# Altium project HEATER SYSTEM PID.PrjPcb
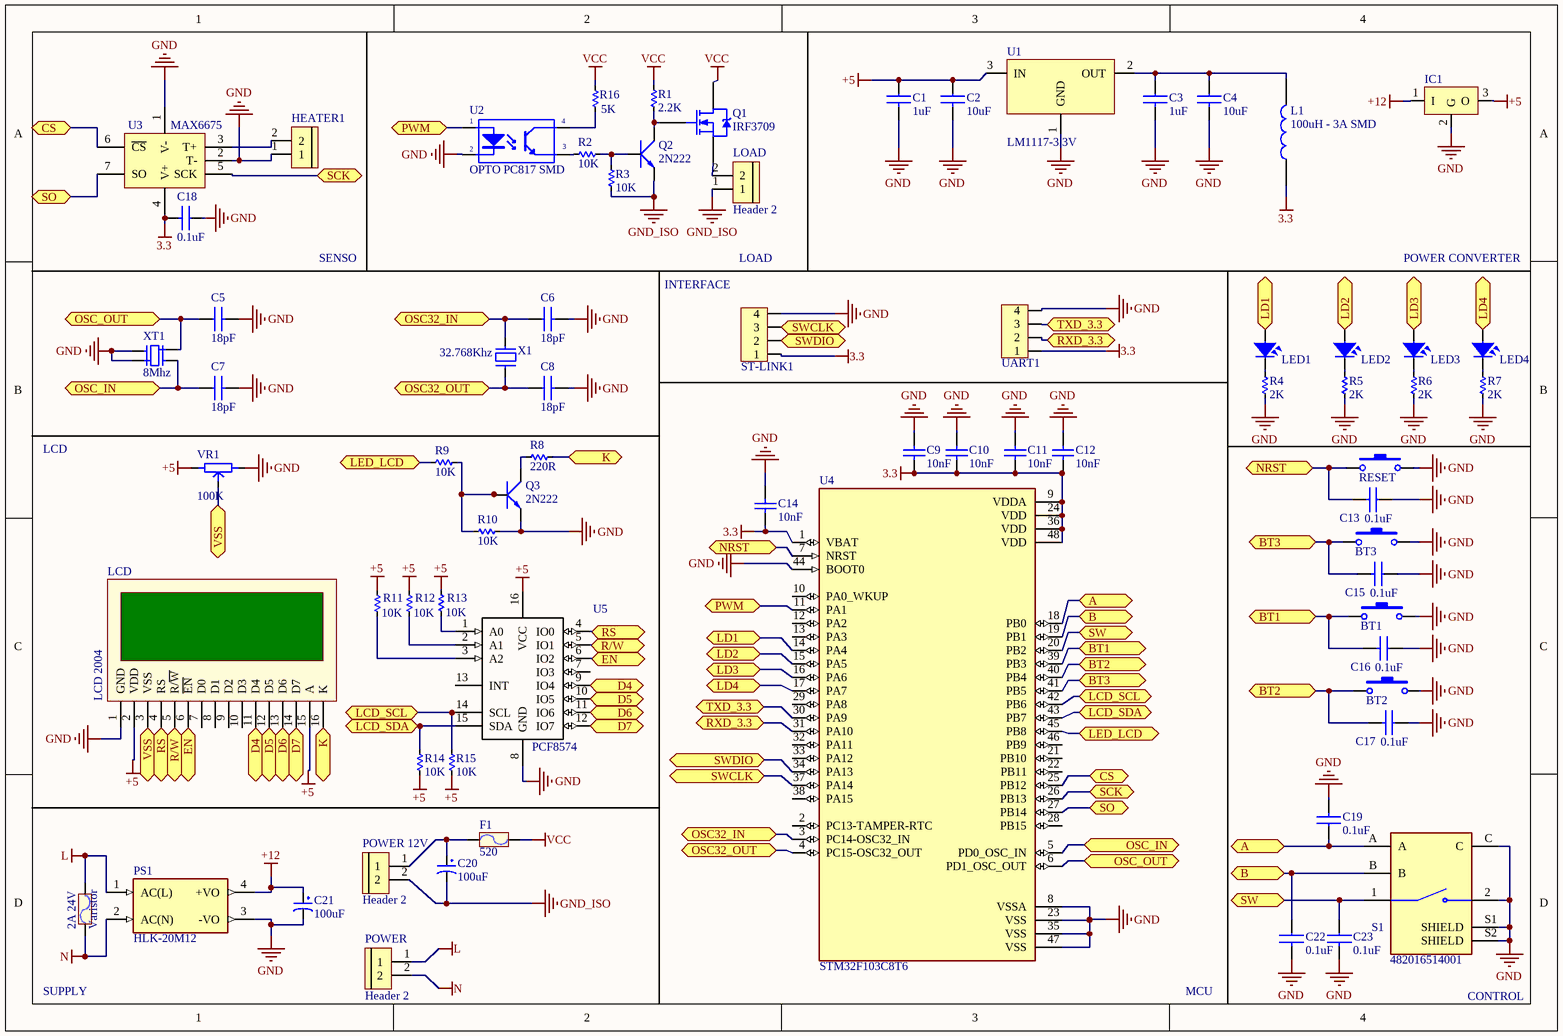
[diagram p0: Sheet1.SchDoc]
1 sheet, 71 parts. Net scope: flat (ports and power ports of the same name join across sheets).
Board file: PCB1.PcbDoc

## Sheet Sheet1.SchDoc
size A4; SheetNumber: 1; SheetTotal: 1

### Parts
BT1  SW-SMD  [SW-SMD]  (value not drawn)
BT2  SW-SMD  [SW-SMD]  (value not drawn)
BT3  SW-SMD  [SW-SMD]  (value not drawn)
C1  1uF  [0805]
C2  10uF  [0805]
C3  1uF  [0805]
C4  10uF  [0805]
C5  18pF  [0805]
C6  18pF  [0805]
C7  18pF  [0805]
C8  18pF  [0805]
C9  10nF  [tu 0805]
C10  10nF  [tu 0805]
C11  10nF  [tu 0805]
C12  10nF  [tu 0805]
C13  0.1uF  [0805]
C14  10nF  [tu 0805]
C15  0.1uF  [0805]
C16  0.1uF  [0805]
C17  0.1uF  [0805]
C18  0.1uF  [0805]
C19  0.1uF  [0805]
C20  100uF  [tu hoa 5mm]
C21  100uF  [tu hoa 5mm]
C22  0.1uF  [0805]
C23  0.1uF  [0805]
F1  520  [De Cau Chi 520 630]
HEATER1  Header 2  [BIG_Header 2]  (value not drawn)
IC1  LM78xx  [TO252-123]  (value not drawn)
L1  100uH - 3A SMD  [Cuon Cam 12x12x10]
LCD  LCD 2004  [LCD 2004]
LED1  LED  [LED-0805-Red]  (value not drawn)
LED2  LED  [LED-0805-Red]  (value not drawn)
LED3  LED  [LED-0805-Red]  (value not drawn)
LED4  LED  [LED-0805-Red]  (value not drawn)
LOAD  Header 2  [BIG_Header 2]
POWER  Header 2  [BIG_Header 2]
POWER_12V  Header 2  [BIG_Header 2]
PS1  HLK-20M12  [CONV_HLK-20M12]
Q1  IRF3709  [D2PAK]
Q2  2N222  [SOT23-231]
Q3  2N222  [SOT23-231]
R1  2.2K  [RES-SMD-1206]
R2  10K  [RES-SMD-1206]
R3  10K  [RES-SMD-1206]
R4  2K  [RES-SMD-0805]
R5  2K  [RES-SMD-0805]
R6  2K  [RES-SMD-0805]
R7  2K  [RES-SMD-0805]
R8  220R  [RES-SMD-0805]
R9  10K  [RES-SMD-0805]
R10  10K  [RES-SMD-0805]
R11  10K  [RES-SMD-0805]
R12  10K  [RES-SMD-0805]
R13  10K  [RES-SMD-0805]
R14  10K  [RES-SMD-0805]
R15  10K  [RES-SMD-0805]
R16  5K  [RES-SMD-1206]
RESET  SW-SMD  [SW-SMD]  (value not drawn)
S1  482016514001  [SW_482016514001]
ST-LINK1  Header4  [Header4]  (value not drawn)
U1  LM1117-3.3V  [SOT223]
U2  OPTO PC817 SMD  [SOP4]
U3  MAX6675  [SO8]
U4  STM32F103C8T6  [QFP50P900X900X160-48N]
U5  PCF8574  [SO16L]
UART1  Header4  [Header4]  (value not drawn)
Varistor  2A 24V  [Cau chi tu phuc hoi 2A 24V SMD1812]
VR1  100K  [Bien Tro Tam Giac Dung]
X1  32.768Khz  [XT2-32.768KHz-2_V]
XT1  8Mhz  [Thach Anh 4 chan 1]

### Ports
A (bidir), B (bidir), BT1 (bidir), BT2 (bidir), BT3 (bidir), CS (bidir), D4 (bidir), D5 (bidir), D6 (bidir), D7 (bidir), EN (bidir), K (bidir), LCD_SCL (bidir), LCD_SDA (bidir), LD1 (bidir), LD2 (bidir), LD3 (bidir), LD4 (bidir), LED_LCD (bidir), NRST (bidir), OSC32_IN (bidir), OSC32_OUT (bidir), OSC_IN (bidir), OSC_OUT (bidir), PWM (bidir), R/W (bidir), RS (bidir), RXD_3.3 (bidir), SCK (bidir), SO (bidir), SW (bidir), SWCLK (bidir), SWDIO (bidir), TXD_3.3 (bidir), VSS (bidir)

### Nets
3.3: C9.2 C10.2 C11.2 C12.2 C14.2 C18.2 L1.1 ST-LINK1.1 U3.4(V+) U4.1(VBAT) U4.9(VDDA) U4.24(VDD) U4.36(VDD) U4.48(VDD) UART1.1
+5: C1.1 C2.1 IC1.3(O) LCD.2(VDD) LCD.15(A) R11.1 R12.1 R13.1 R14.1 R15.1 U1.3(IN) U5.16(VCC) VR1.3
+12: C21.1 IC1.1(I) PS1.4(+VO)
GND: BT1.2 BT2.2 BT3.2 C1.2 C2.2 C3.2 C4.2 C5.2 C6.2 C7.2 C8.2 C9.1 C10.1 C11.1 C12.1 C13.1 C14.1 C15.1 C16.1 C17.1 C18.1 C19.2 C21.2 C22.2 C23.2 HEATER1.1 IC1.2(G) LCD.1(GND) PS1.3(-VO) Q3.1(E) R4.2 R5.2 R6.2 R7.2 R10.1 RESET.2 S1.2 S1.C S1.S1(SHIELD) S1.S2(SHIELD) ST-LINK1.4 U1.1(GND) U2.2(K) U3.1(V-) U3.2(T-) U4.8(VSSA) U4.23(VSS) U4.35(VSS) U4.44(BOOT0) U4.47(VSS) U5.8(GND) UART1.4 VR1.1 XT1.2 XT1.4
GND_ISO: C20.2 LOAD.1 POWER_12V.2 Q2.1(E) R3.2
L: POWER.1 PS1.1(AC(L)) Varistor.2
N: POWER.2 PS1.2(AC(N)) Varistor.1
VCC: F1.2 Q1.2(D) R1.1 R16.2
NetBT1_1: BT1.1 C16.2 U4.39(PB3) ; port BT1
NetBT2_1: BT2.1 C17.2 U4.40(PB4) ; port BT2
NetBT3_1: BT3.1 C15.2 U4.41(PB5) ; port BT3
NetC3_1: C3.1 C4.1 L1.2 U1.2(OUT)
NetC5_1: C5.1 U4.6(PD1_OSC_OUT) XT1.3 ; port OSC_OUT
NetC6_1: C6.1 U4.3(PC14-OSC32_IN) X1.2 ; port OSC32_IN
NetC7_1: C7.1 U4.5(PD0_OSC_IN) XT1.1 ; port OSC_IN
NetC8_1: C8.1 U4.4(PC15-OSC32_OUT) X1.1 ; port OSC32_OUT
NetC13_2: C13.2 RESET.1 U4.7(NRST) ; port NRST
NetC19_1: C19.1 S1.A U4.18(PB0) ; port A
NetC20_1: C20.1 F1.1 POWER_12V.1
NetC22_1: C22.1 S1.B U4.19(PB1) ; port B
NetC23_1: C23.1 S1.1 U4.20(PB2) ; port SW
NetHEATER1_2: HEATER1.2 U3.3(T+)
NetLCD_3: LCD.3(VSS) VR1.2 ; port VSS
NetLCD_4: LCD.4(RS) U5.4(IO0) ; port RS
NetLCD_5: LCD.5(R/~{W}) U5.5(IO1) ; port R/W
NetLCD_6: LCD.6(~{EN}) U5.6(IO2) ; port EN
NetLCD_11: LCD.11(D4) U5.9(IO4) ; port D4
NetLCD_12: LCD.12(D5) U5.10(IO5) ; port D5
NetLCD_13: LCD.13(D6) U5.11(IO6) ; port D6
NetLCD_14: LCD.14(D7) U5.12(IO7) ; port D7
NetLCD_16: LCD.16(K) R8.1 ; port K
NetLED1_1: LED1.1 U4.14(PA4) ; port LD1
NetLED1_2: LED1.2 R4.1
NetLED2_1: LED2.1 U4.15(PA5) ; port LD2
NetLED2_2: LED2.2 R5.1
NetLED3_1: LED3.1 U4.16(PA6) ; port LD3
NetLED3_2: LED3.2 R6.1
NetLED4_1: LED4.1 U4.17(PA7) ; port LD4
NetLED4_2: LED4.2 R7.1
NetLOAD_2: LOAD.2 Q1.3(S)
NetQ1_1: Q1.1(G) Q2.3(C) R1.2
NetQ2_2: Q2.2(B) R2.2 R3.1
NetQ3_2: Q3.2(B) R9.1 R10.2
NetQ3_3: Q3.3(C) R8.2
NetR2_1: R2.1 U2.3(E)
NetR9_2: R9.2 U4.45(PB8) ; port LED_LCD
NetR11_2: R11.2 U5.3(A2)
NetR12_2: R12.2 U5.2(A1)
NetR13_2: R13.2 U5.1(A0)
NetR14_2: R14.2 U4.43(PB7) U5.15(SDA) ; port LCD_SDA
NetR15_2: R15.2 U4.42(PB6) U5.14(SCL) ; port LCD_SCL
NetR16_1: R16.1 U2.4(C)
NetST-LINK1_2: ST-LINK1.2 U4.34(PA13) ; port SWDIO
NetST-LINK1_3: ST-LINK1.3 U4.37(PA14) ; port SWCLK
NetU2_1: U2.1(A) U4.11(PA1) ; port PWM
NetU3_5: U3.5(SCK) U4.26(PB13) ; port SCK
NetU3_6: U3.6(~{CS}) U4.25(PB12) ; port CS
NetU3_7: U3.7(SO) U4.27(PB14) ; port SO
NetU4_30: U4.30(PA9) UART1.3 ; port TXD_3.3
NetU4_31: U4.31(PA10) UART1.2 ; port RXD_3.3

Not connected (* = marked no-connect by the designer): LCD 7(D0) 8(D1) 9(D2) 10(D3); U4 2(PC13-TAMPER-RTC) 10(PA0_WKUP) 12(PA2) 13(PA3) 21(PB10) 22(PB11) 28(PB15) 29(PA8) 32(PA11) 33(PA12) 38(PA15) 46(PB9); U5 7(IO3) 13(INT)

### Notes on the sheet
- SENSO
- (near ST-LINK1) INTERFACE
- LOAD
- POWER CONVERTER
- LCD
- SUPPLY
- MCU
- (near S1) CONTROL

### Library data of the parts
BT1-BT3 RESET = SW-SMD: Switch; Published: 24-Mar-1999; LatestRevisionDate: 17-Jul-2002; LatestRevisionNote: Re-released for DXP Platform.; PackageReference: SPST-2; Publisher: Altium Limited
C1-C8 C13 C15-C19 C22 C23 = CAP 0805: Right: 20; Bottom: 10
C9-C12 C14 = Tu 0805 101 50V 20%: Dán; Don_Vi: Con; So_Chan: 2; Ten_Linh_Kien: Tụ 0805 101-0.1nF 50V 20%; Ma_Hang: MH002806; Chung_Loai: Dán; Kieu_Chan: *
C20 C21 = Tu Hoa 100uF 25V 6x11: Cắm; Don_Vi: Con; So_Chan: 2; Ten_Linh_Kien: Tụ Hóa 100uF 25V 6x11MM; Ma_Hang: MH001351; Chung_Loai: Cắm; Kieu_Chan: *
F1 = De Cau Chi 520 630: 5x20mm; Ma_Hang: MH001473; Ten: Đế Cầu Chì 5x20MM 6x30MM SMD01
HEATER1 LOAD POWER POWER_12V = Header 2: Big Header 2
IC1 = LM78xx: Positive Voltage Regulator; Note: Tab is connected to pin 3 (GND).; Published: 24-Aug-2001; LatestRevisionDate: 17-Jul-2002; LatestRevisionNote: Re-released for DXP Platform.; DatasheetVersion: Apr-1994; PackageVersion: Jul-1998; PackageReference: ISOWATT220AB; Publisher: Altium Limited; PackageDescription: TO, Thru-Hole, Vertical, Heatsink Mounted; 3 In-Line Leads; Pitch 2.54 mm; Pin sequence 1, 3, 2; ComponentLink1Description: Manufacturer Link; ComponentLink1URL: http://www.st.com/; ComponentLink2Description: Datasheet; ComponentLink2URL: http://www.st.com/stonline/products/literature/ds/2146/l78m05c.pdf
L1 = CUON CAM 100uH SMD: Dán; Don_Vi: Con; Ma_Hang: MH003999; Ten_Linh_Kien: Cuộn Cảm 100uH 7x7x4MM CD74; Ma_Hang: *; Kieu_Chan: *; Chung_Loai: Dán
LCD = LCD 2004 5V: LCD 2004 5V Xanh Dương; Ten: LCD 2004 Xanh Dương; Ma_Hang: WVEZ; CHIP: HD44780; Don Vi Mua: Nshop
LED1-LED4 = LED SMD: Value: LED 3 - 5 ly 2 Colour
PS1 = HLK-20M12: 20W ultra-small series module power supply; MF: Hi-link; Check_prices: https://www.snapeda.com/parts/HLK-20M12/Hi-link/view-part/?ref=eda; SnapEDA_Link: https://www.snapeda.com/parts/HLK-20M12/Hi-link/view-part/?ref=snap; Availability: Not in stock; Price: None; Value: *; MP: HLK-20M12; Package: Non-Standard Hi-link
Q1 = IRF3709S SMD: N-Channel Power MOSFET
Q2 Q3 = 2N222: NPN 600mW, ECB; Value: C1815
R1-R16 = Res-SMD: Resistor; Manufacturer: Generic Components; Class: Passive; Published: 08/06/2000; Publisher: Altium Hobart Technology Centre
S1 = 482016514001: Rotary Encoder Mechanical 15 Quadrature (Incremental) Vertical; MF: WÃ¼rth Elektronik; Purchase-URL: https://pricing.snapeda.com/search/part/482016514001/?ref=eda; MP: 482016514001; Package: None; Availability: In Stock; Value: *; Price: None; Check_prices: https://www.snapeda.com/parts/482016514001/Wurth+Electronics+Inc./view-part/?ref=eda; SnapEDA_Link: https://www.snapeda.com/parts/482016514001/Wurth+Electronics+Inc./view-part/?ref=snap
ST-LINK1 UART1 = Header4: Header IDC, 4 x 1 Pin Vertical 2.54mm Pitch (Non-Boxed, Male); Manufacturer: W¨¹rth Elektronik eiSos GmbH; partNo: 613002143121; ComponentLink1 Description: Manufacturer; ComponentLink2 Description: Datasheet; NoPins: 02; Created Date: 29 March 2013; ComponentLink1URL: http://www.we-online.com; ComponentLink2URL: http://katalog.we-online.de/em/datasheet/6130xx143121.pdf; Created by: Karrer Zheng
U1 = LM1117: 800mA Low-Dropout Linear Regulator; Creator: Nguyen Ba Bien; Website: http://group3i.net
U2 = OPTO PC817 SMD: Single Opto; Value: PC817
U3 = MAX6675: Half-Bridge Driver
U4 = STM32F103C8T6: ARMÂ® CortexÂ®-M3 STM32F1 Microcontroller IC 32-Bit 72MHz 64KB (64K x 8) FLASH 48-LQFP (7x7); MF: STMicroelectronics; Package: LQFP-48 STMicroelectronics; Price: None; Check_prices: https://www.snapeda.com/parts/STM32F103C8T6/STMicroelectronics/view-part/?ref=eda; Value: *; SnapEDA_Link: https://www.snapeda.com/parts/STM32F103C8T6/STMicroelectronics/view-part/?ref=snap; MP: STM32F103C8T6; Availability: In Stock; Purchase-URL: https://pricing.snapeda.com/search/part/STM32F103C8T6/?ref=eda
U5 = PCF8574: I2C PORT EXPANDER; Manufacturer Part Number: PCF8574T/3,512; Manufacturer: NXP Semiconductors; Includes: POR; Interface: I²C; Interrupt Output: Yes; Number of I /O: 8; Voltage - Supply: 2.5 V ~ 6 V; Frequency - Clock: 100KHz; Supplier 1: Digi-Key; Supplier Part Number 1: 568-1076-5-ND; Package / Case: 16-SOIC (7.5mm Width); Category: Integrated Circuits (ICs); Supplier Part Number: 568-1076-5-ND; Operating Temperature: -40°C ~ 85°C; Packaging: Tube; RoHS: RoHS Compliant; Supplier: Digi-Key
Varistor = Cau chi tu phuc hoi 2A 24V SMD1812: 2A 24V SMD1812; Ma_Hang: MH010033; Ten: Cầu Chì Tự Phục Hồi 2A 24V SMD1812
VR1 = Bien tro tam giac 100K Dung: Cắm; Don_Vi: Con; Ten_Linh_Kien: Biến Trở Tam Giác 104-100K RM065; Ma_Hang: MH003711; Chung_Loai: Cắm; Ghi_Chu: *; Kieu_Chan: *
X1 = XT2: Crystal, 32.768 KHz, -40 to 85 degC, 3.2 x 1.5 x 0.9 mm SMD; Value: 4Mhz
XT1 = Thach Anh 4 Chan SMD: Crystal For all Crystal 2pin.; Value: 4Mhz